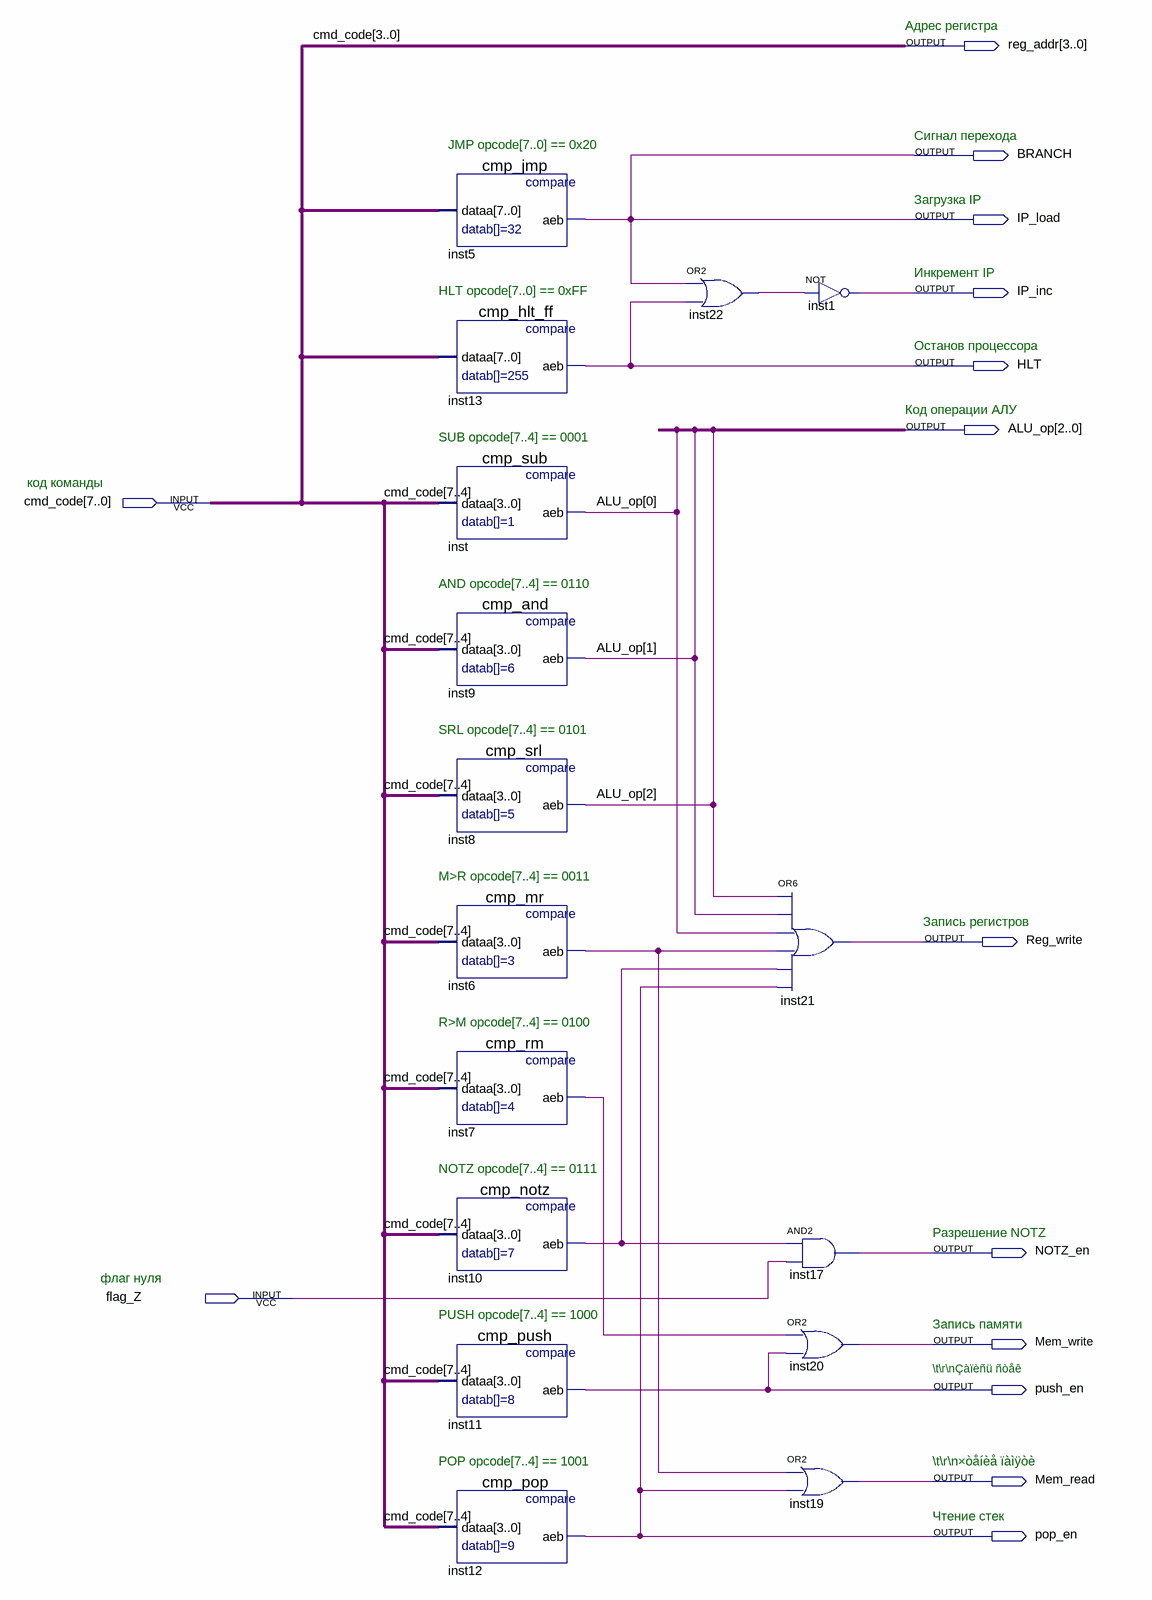
[diagram p0: schematic sheet]
// Quartus schematic decoder_unit.bdf as structural Verilog: 16 symbols, 14 pins
module decoder_unit (
  input  [7:0] cmd_code,
  input  flag_Z,
  output [3:0] reg_addr,
  output BRANCH,
  output IP_load,
  output IP_inc,
  output HLT,
  output [2:0] ALU_op,
  output Reg_write,
  output NOTZ_en,
  output Mem_write,
  output push_en,
  output Mem_read,
  output pop_en
);

  wire inst6_aeb, inst7_aeb, inst10_aeb, inst22_out;

  cmp_jmp inst5 (.dataa(cmd_code), .aeb(BRANCH));
  cmp_hlt_ff inst13 (.dataa(cmd_code), .aeb(HLT));
  cmp_sub inst (.dataa(cmd_code[7:4]), .aeb(ALU_op[0]));
  cmp_and inst9 (.dataa(cmd_code[7:4]), .aeb(ALU_op[1]));
  cmp_srl inst8 (.dataa(cmd_code[7:4]), .aeb(ALU_op[2]));
  cmp_mr inst6 (.dataa(cmd_code[7:4]), .aeb(inst6_aeb));
  cmp_rm inst7 (.dataa(cmd_code[7:4]), .aeb(inst7_aeb));
  cmp_notz inst10 (.dataa(cmd_code[7:4]), .aeb(inst10_aeb));
  cmp_push inst11 (.dataa(cmd_code[7:4]), .aeb(push_en));
  cmp_pop inst12 (.dataa(cmd_code[7:4]), .aeb(pop_en));
  or inst22 (inst22_out, BRANCH, HLT);
  not inst1 (IP_inc, inst22_out);
  or inst21 (Reg_write, ALU_op[2], ALU_op[1], ALU_op[0], inst6_aeb, inst10_aeb, pop_en);
  and inst17 (NOTZ_en, inst10_aeb, flag_Z);
  or inst20 (Mem_write, inst7_aeb, push_en);
  or inst19 (Mem_read, inst6_aeb, pop_en);

  assign IP_load = BRANCH;
  assign reg_addr = cmd_code[3:0];

  // Notes on the sheet:
  //   Адрес регистра
  //   Сигнал перехода
  //   JMP opcode[7..0] == 0x20
  //   Загрузка IP
  //   Инкремент IP
  //   HLT opcode[7..0] == 0xFF
  //   Останов процессора
  //   Код операции АЛУ
  //   SUB opcode[7..4] == 0001
  //   код команды
  //   AND opcode[7..4] == 0110
  //   SRL opcode[7..4] == 0101
  //   M>R opcode[7..4] == 0011
  //   Запись регистров
  //   R>M opcode[7..4] == 0100
  //   NOTZ opcode[7..4] == 0111
  //   Разрешение NOTZ
  //   флаг нуля
  //   PUSH opcode[7..4] == 1000
  //   Запись памяти
  //   \t\r\nÇàïèñü ñòåê
  //   POP opcode[7..4] == 1001
  //   \t\r\n×òåíèå ïàìÿòè
  //   Чтение стек
endmodule
